# EAGLE design scanner (EAGLE 9.2.2)

## Sheet 1 of 3: IO
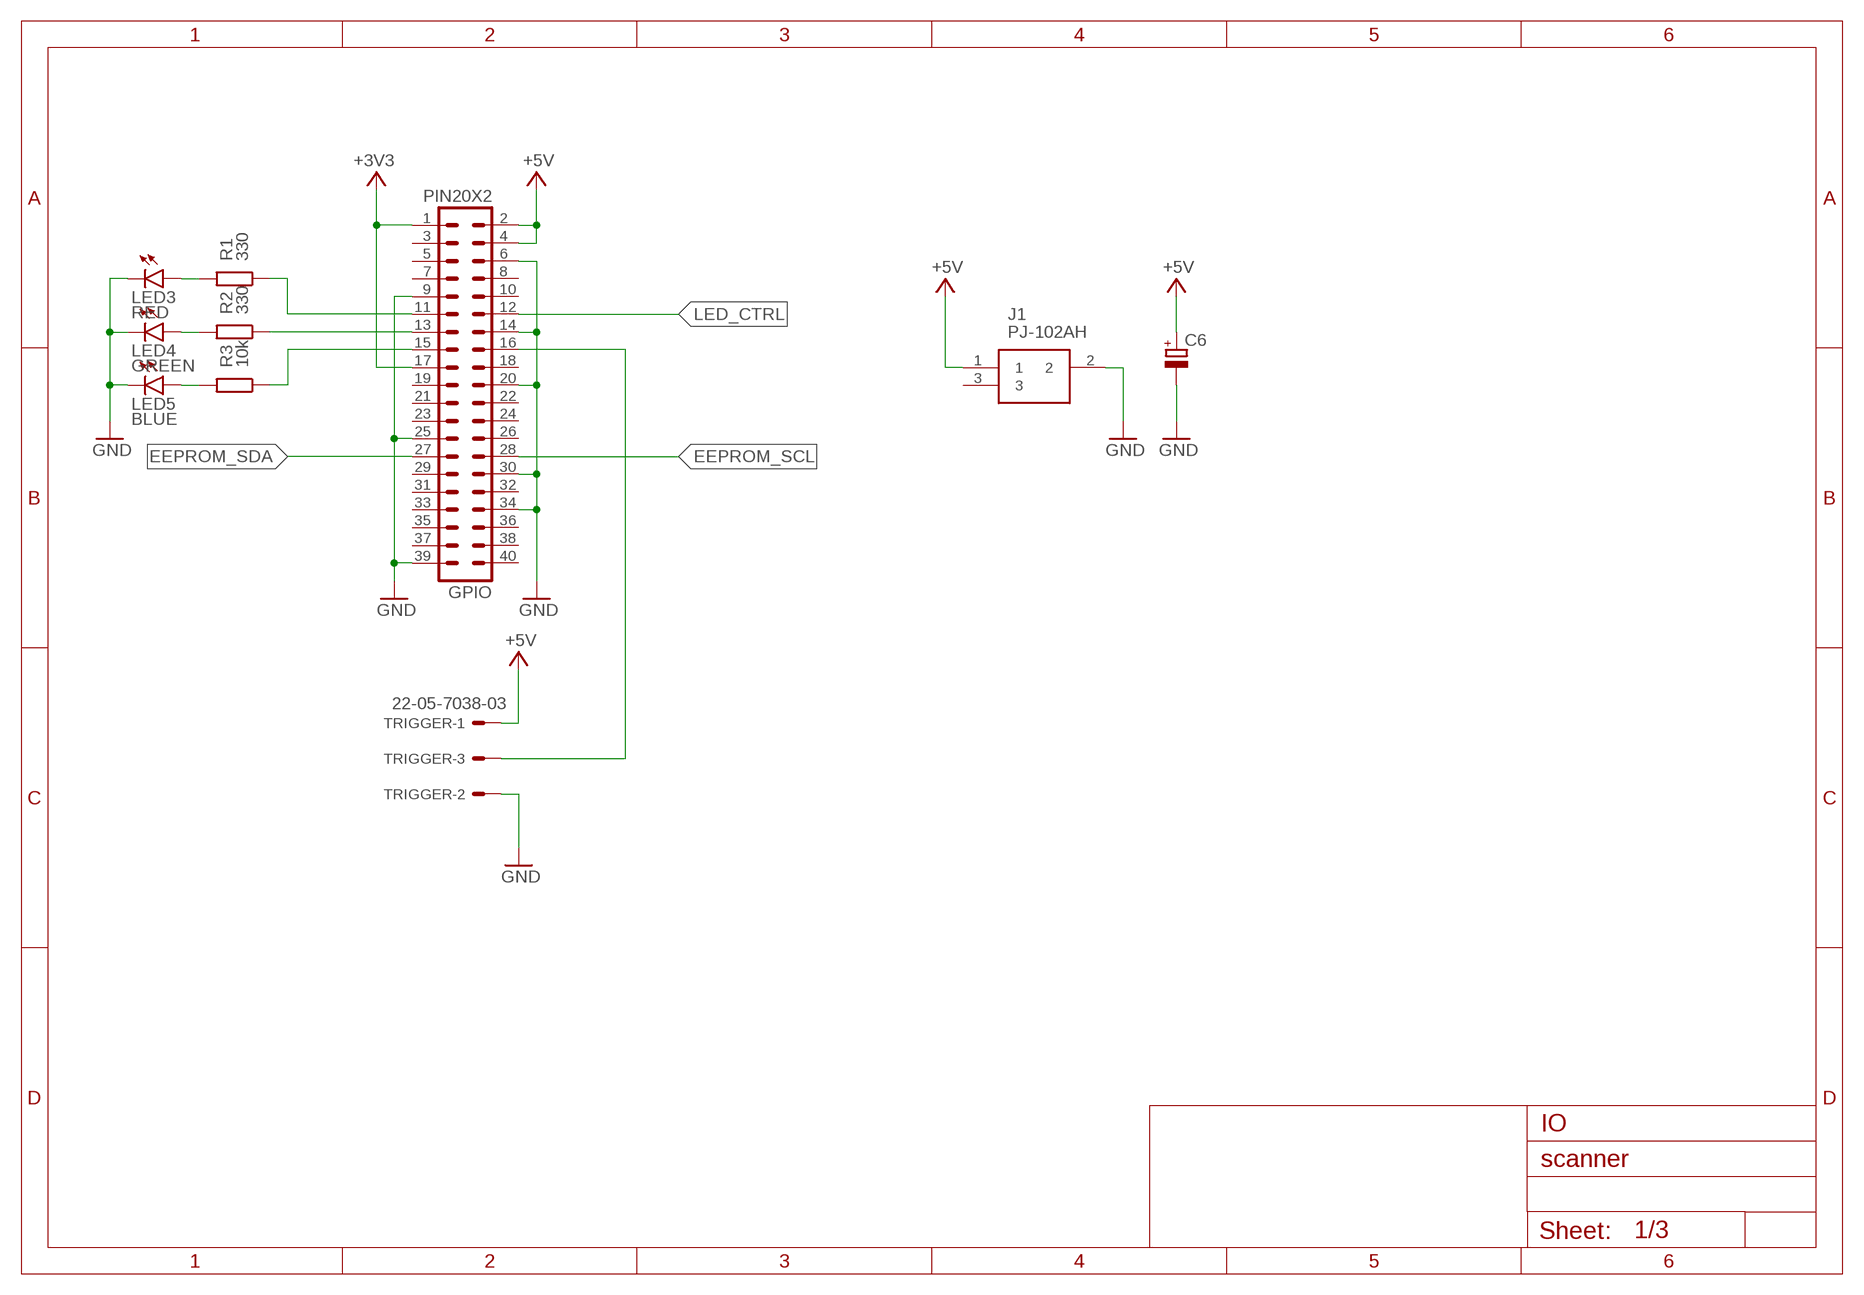
[diagram p0: schematic, sheet 1]

### Parts
C6  CPOL-EUCT6032  [CT6032]
GPIO  PIN20X2  [PIN_20X2]
J1  PJ-102AH  [PJ-102AH]
LED3  RED  LEDCHIP-LED0805  [CHIP-LED0805]
LED4  GREEN  LEDCHIP-LED0805  [CHIP-LED0805]
LED5  BLUE  LEDCHIP-LED0805  [CHIP-LED0805]
R1  330  R-EU_M0805  [M0805]
R2  330  R-EU_M0805  [M0805]
R3  10k  R-EU_M0805  [M0805]
TRIGGER  22-05-7038-03  [7395-03]

### Nets
+3V3: GPIO.1 GPIO.17 ; also sheet 2,3
+5V: C6.+ GPIO.2 GPIO.4 J1.1 TRIGGER.1 ; also sheet 2
EEPROM_SCL: GPIO.28 ; also sheet 3
EEPROM_SDA: GPIO.27 ; also sheet 3
GND: C6.- GPIO.6 GPIO.9 GPIO.14 GPIO.20 GPIO.25 GPIO.30 GPIO.34 GPIO.39 J1.2 LED3.C LED4.C LED5.C TRIGGER.2 ; also sheet 2,3
LED3: GPIO.11 R1.1
LED4: GPIO.13 R2.1
LED5: GPIO.15 R3.1
LED_CTRL: GPIO.12 ; also sheet 2
N$13: LED3.A R1.2
N$17: LED4.A R2.2
N$18: LED5.A R3.2
TRIGGER: GPIO.16 TRIGGER.3
Unconnected: GPIO.3 GPIO.5 GPIO.7 GPIO.8 GPIO.10 GPIO.18 GPIO.19 GPIO.21 GPIO.22 GPIO.23 GPIO.24 GPIO.26 GPIO.29 GPIO.31 GPIO.32 GPIO.33 GPIO.35 GPIO.36 GPIO.37 GPIO.38 GPIO.40 J1.3

### Notes on the sheet
- IO

## Sheet 2 of 3: LED Driver
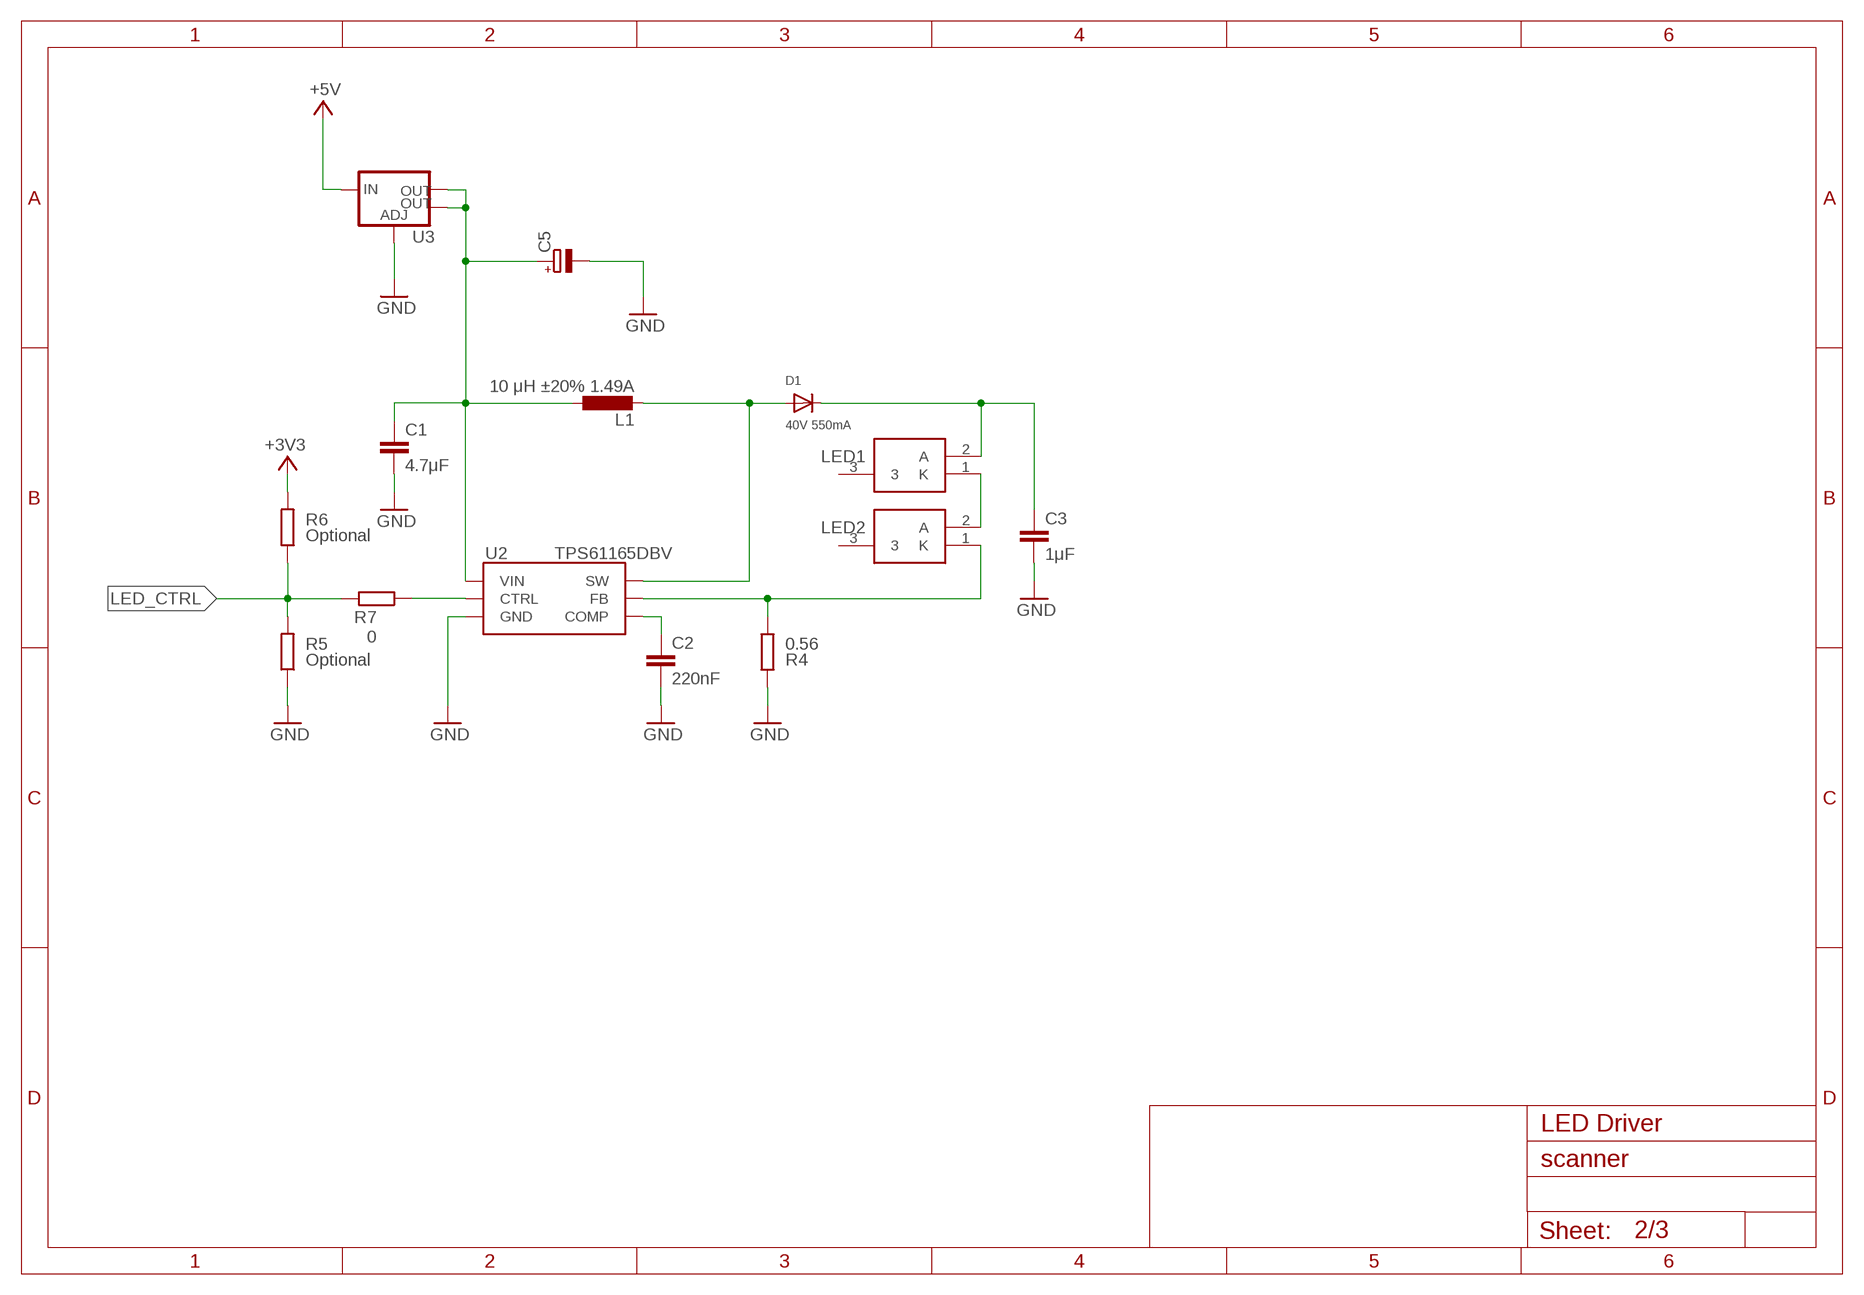
[diagram p1: schematic, sheet 2]

### Parts
C1  4.7μF  C-EUC0805K  [C0805K]
C2  220nF  C-EUC0805K  [C0805K]
C3  1μF  C-EUC0805K  [C0805K]
C5  CPOL-EUCT6032  [CT6032]
D1  40V 550mA  DIODESOD-123  [SOD-123]
L1  10 μH ±20% 1.49A  D53LC  [D53LC]
LED1  LW_W5SM-JYKY-JKQL-1  [LWW5SMJYKYJKQL1]
LED2  LW_W5SM-JYKY-JKQL-1  [LWW5SMJYKYJKQL1]
R4  0.56  R-EU_M0805  [M0805]
R5  Optional  R-EU_M0805  [M0805]
R6  Optional  R-EU_M0805  [M0805]
R7  0  R-EU_M0805  [M0805]
U2  TPS61165DBV  [SOT-23-6]
U3  V_REG_LM1117SOT223  [SOT223]

### Nets
+3V3: R6.2 ; also sheet 1,3
+5V: U3.3(IN) ; also sheet 1
GND: C1.2 C2.2 C3.2 C5.- R4.2 R5.1 U2.4(GND) U3.1(ADJ) ; also sheet 1,3
LED_COMP: C2.1 U2.5(COMP)
LED_CTRL: R5.2 R6.1 R7.2 ; also sheet 1
LED_CTRL1: R7.1 U2.2(CTRL)
LED_FB: LED2.1(K) R4.1 U2.6(FB)
LED_SW: D1.A L1.2 U2.3(SW)
N$2: C3.1 D1.C LED1.2(A)
N$3: LED1.1(K) LED2.2(A)
VCC: C1.1 C5.+ L1.1 U2.1(VIN) U3.2(OUT) U3.4(OUT)
Unconnected: LED1.3 LED2.3

### Notes on the sheet
- LED Driver

## Sheet 3 of 3: EEPROM
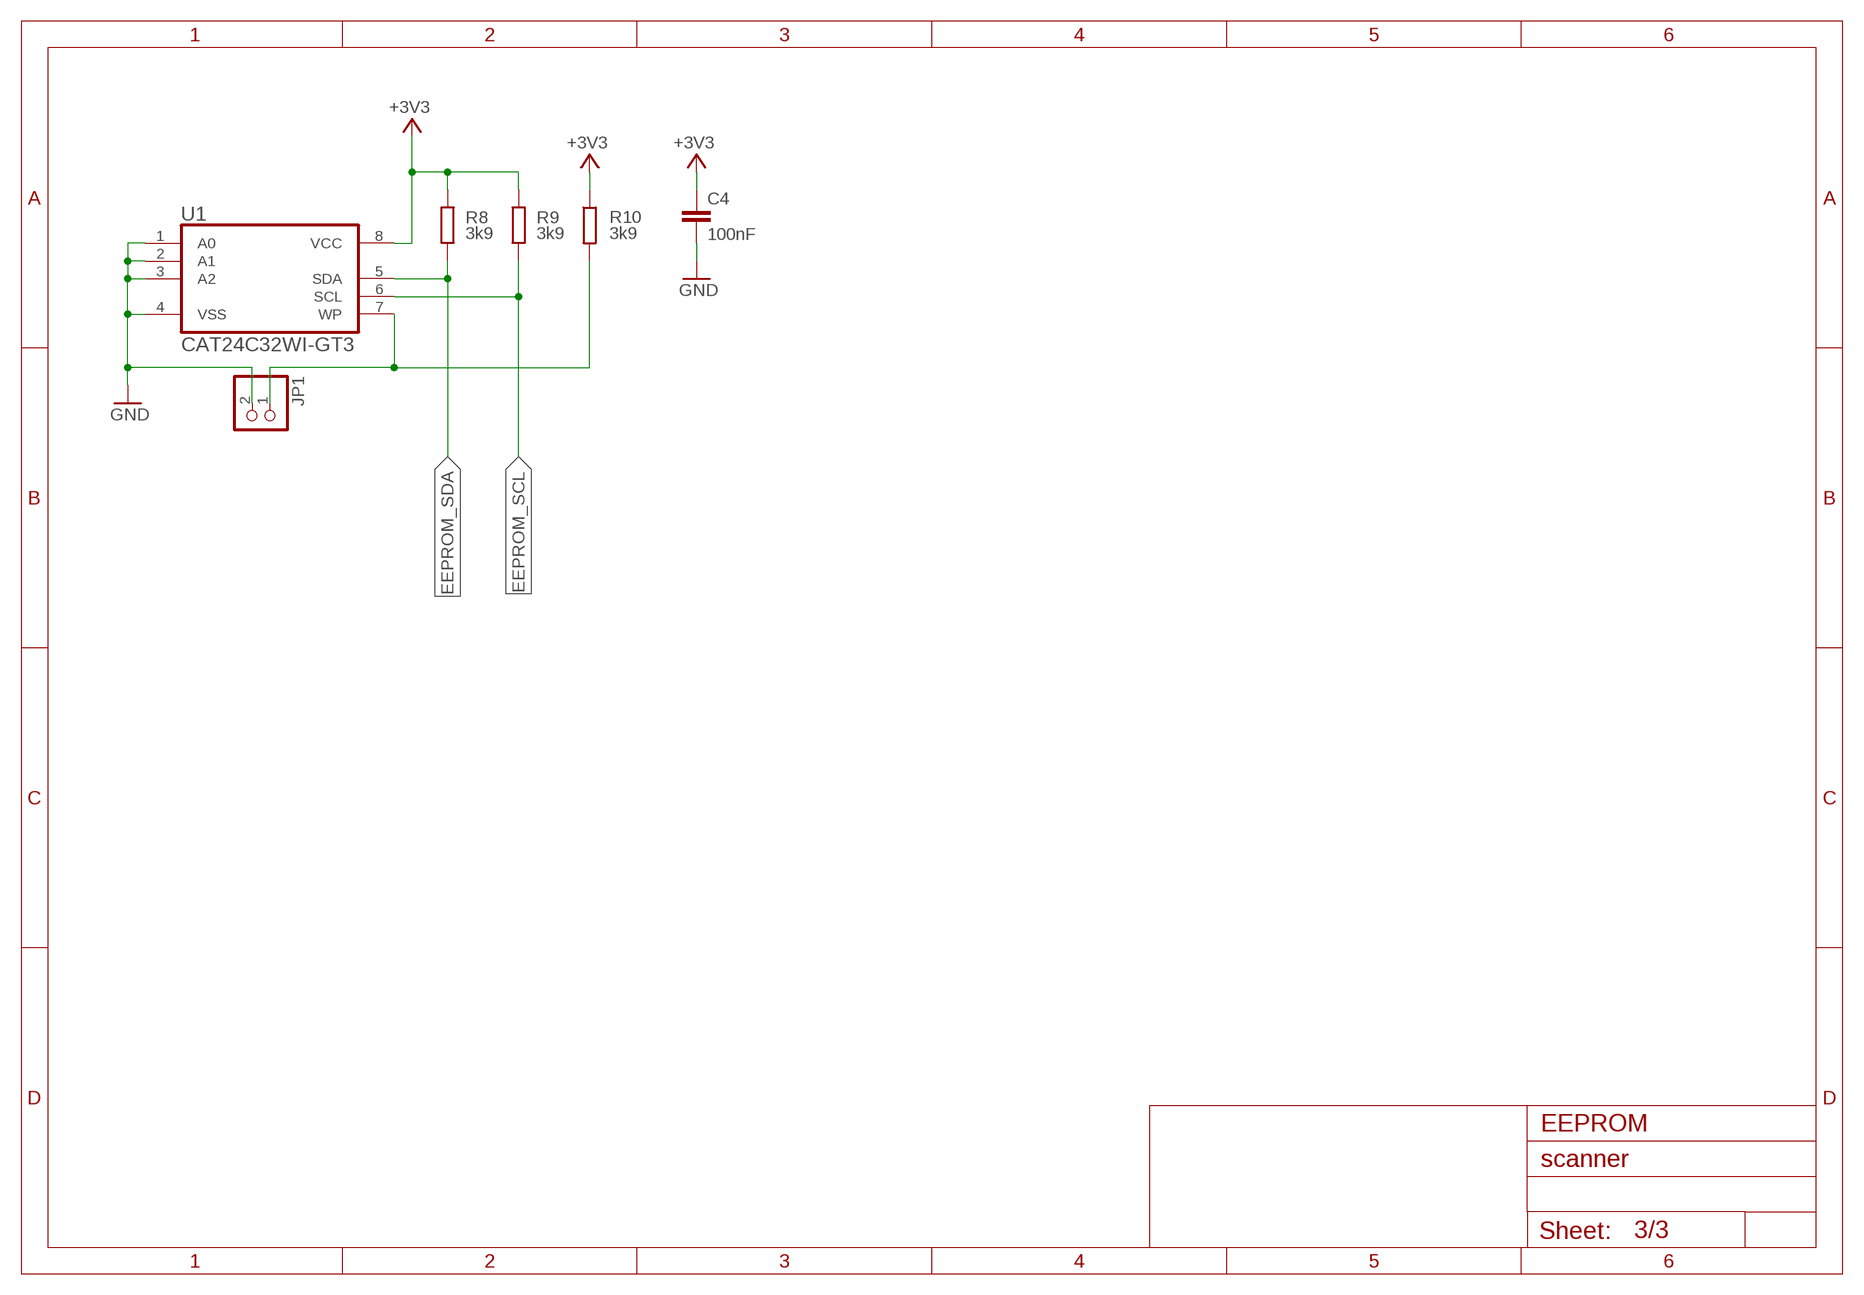
[diagram p2: schematic, sheet 3]

### Parts
C4  100nF  C-EUC0805K  [C0805K]
JP1  PINHD-1X2  [1X02]
R8  3k9  R-EU_M0805  [M0805]
R9  3k9  R-EU_M0805  [M0805]
R10  3k9  R-EU_M0805  [M0805]
U1  CAT24C32WI-GT3  [SOIC127P600X175-8N]

### Nets
+3V3: C4.1 R8.2 R9.2 R10.1 U1.8(VCC) ; also sheet 1,2
EEPROM_SCL: R9.1 U1.6(SCL) ; also sheet 1
EEPROM_SDA: R8.1 U1.5(SDA) ; also sheet 1
EEPROM_WP: JP1.1 R10.2 U1.7(WP)
GND: C4.2 JP1.2 U1.1(A0) U1.2(A1) U1.3(A2) U1.4(VSS) ; also sheet 1,2

### Notes on the sheet
- EEPROM

## Library data of the parts
C1-C4 = resistor:C-EU: CAPACITOR, European symbol; DIELECTRIC: X7R
C5 C6 = rcl:CPOL-EU: POLARIZED CAPACITOR, European symbol; SPICEPREFIX: C
D1 = adafruit:DIODE: Diode SMADIODE - SMA Surface Mount Package 20V 1A Schottky Diode Digikey: 641-1014-6-ND DO-1N4148 - Through Hole Small Current Diode SOD-123 20V 1 A (.5mV Vf) Schottky Diode - Digikey: MBRX120TPMSCT-ND SOD-323 10V 570mA (.38mV Vf, 3ns) Schottky Diode - Digikey: ZLLS410CT-ND SOD-523 30V 30mA Schottky Diode (RB751S-40TE61) - Digikey: RB751S-40TE61CT-ND SOT23-R/W - SOT23 Package (R = Solder Paste/Reflow Ovens, W = Hand-Soldering) BAT54Film 40V 300mA - Digikey: 497-7162-1-ND
GPIO = FLYFISH:PIN20X2
J1 = PJ-102AH:PJ-102AH: DC POWER JACK Source: Datasheet <https://componentsearchengine.com/Datasheets/1/PJ-102AH.pdf>; DESCRIPTION: DC POWER JACK; HEIGHT: mm; MANUFACTURER_NAME: CUI; MANUFACTURER_PART_NUMBER: PJ-102AH; MOUSER_PART_NUMBER: 490-PJ-102AH
JP1 = pinhead:PINHD-1X2: PIN HEADER
L1 = m-pad-2.1:D53LC: TOKO's D53LC Fixed Inductors for Surface Mounting TYPE D53LC Inductance Range:1.1 - 220mH Frequency Range: 0.1 - 1MHz Features Low profile (3.0mm max.) Magnetically shielded Available on tape and reel for auto-insertion Suitable for reflow soldering Part Number A915AY-xxxM Please send any comments to: messi@users.sourceforge.net
LED1 LED2 = LW_W5SM-JYKY-JKQL-1:LW_W5SM-JYKY-JKQL-1: High Power LEDs - White White, 5600K Source: Datasheet <https://www.osram.com/os/ecat/Golden DRAGON LW W5SM/com/en/class_pim_web_catalog_103489/global/prd_pim_device_2190693/>; DESCRIPTION: High Power LEDs - White White, 5600K; HEIGHT: 1mm; MANUFACTURER_NAME: OSRAM Opto Semiconductors; MANUFACTURER_PART_NUMBER: LW W5SM-JYKY-JKQL-1; MOUSER_PART_NUMBER: 720-LWW5SMJYKYJKQL1; MOUSER_PRICE-STOCK: https://www.mouser.com/Search/Refine.aspx?Keyword=720-LWW5SMJYKYJKQL1
LED3-LED5 = led:LED: LED OSRAM: - CHIPLED LG R971, LG N971, LY N971, LG Q971, LY Q971, LO R971, LY R971 LH N974, LH R974 LS Q976, LO Q976, LY Q976 LO Q996 - Hyper CHIPLED LW Q18S LB Q993, LB Q99A, LB R99A - SideLED LS A670, LO A670, LY A670, LG A670, LP A670 LB A673, LV A673, LT A673, LW A673 LH A674 LY A675 LS A676, LA A676, LO A676, LY A676, LW A676 LS A679, LY A679, LG A679 - Hyper Micro SIDELED® LS Y876, LA Y876, LO Y876, LY Y876 LT Y87S - SmartLED LW L88C, LW L88S LB L89C, LB L89S, LG L890 LS L89K, LO L89K, LY L89K LS L896, LA L896, LO L896, LY L896 - TOPLED LS T670, LO T670, LY T670, LG T670, LP T670 LSG T670, LSP T670, LSY T670, LOP T670, LYG T670 LG T671, LOG T671, LSG T671 LB T673, LV T673, LT T673, LW T673 LH T674 LS T676, LA T676, LO T676, LY T676, LB T676, LH T676, LSB T676, LW T676 LB T67C, LV T67C, LT T67C, LS T67K, LO T67K, LY T67K, LW E67C LS E67B, LA E67B, LO E67B, LY E67B, LB E67C, LV E67C, LT E67C LW T67C LS T679, LY T679, LG T679 LS T770, LO T770, LY T770, LG T770, LP T770 LB T773, LV T773, LT T773, LW T773 LH T774 LS E675, LA E675, LY E675, LS T675 LS T776, LA T776, LO T776, LY T776, LB T776 LHGB T686 LT T68C, LB T68C - Hyper Mini TOPLED® LB M676 - Mini TOPLED Santana® LG M470 LS M47K, LO M47K, LY M47K Source: http://www.osram.convergy.de LUXEON: - LUMILED® LXK2-PW12-R00, LXK2-PW12-S00, LXK2-PW14-U00, LXK2-PW14-V00 LXK2-PM12-R00, LXK2-PM12-S00, LXK2-PM14-U00 LXK2-PE12-Q00, LXK2-PE12-R00, LXK2-PE12-S00, LXK2-PE14-T00, LXK2-PE14-U00 LXK2-PB12-K00, LXK2-PB12-L00, LXK2-PB12-M00, LXK2-PB14-N00, LXK2-PB14-P00, LXK2-PB14-Q00 LXK2-PR12-L00, LXK2-PR12-M00, LXK2-PR14-Q00, LXK2-PR14-R00 LXK2-PD12-Q00, LXK2-PD12-R00, LXK2-PD12-S00 LXK2-PH12-R00, LXK2-PH12-S00 LXK2-PL12-P00, LXK2-PL12-Q00, LXK2-PL12-R00 Source: www.luxeon.com KINGBRIGHT: KA-3528ASYC Source: www.kingbright.com
R1-R10 = resistor:R-EU_: RESISTOR, European symbol; TOLERANCE: 5%
TRIGGER = con-molex:22-?-03: CONNECTOR wire to board 2.54 mm (.1 inch) pitch header; MF: MOLEX; OC_FARNELL: unknown; OC_NEWARK: unknown
U1 = mbed-HDK-IC:CAT24C32WI-GT3: EEPROM I2C 32-Kb I2C CMOS; MPN: CAT24C32WI-GT3; OC_FARNELL: 1718129; OC_NEWARK: 08R5414; PACKAGE: SOIC-8; SUPPLIER: CATALYST SEMICONDUCTOR
U2 = dword1511-pmic-dcdc:TPS61165: Boost LED driver
U3 = SparkFun-IC-Power:V_REG_LM1117: Voltage Regulator LM1117 Standard adjustable voltage regulator but in SMD form. Spark Fun Electronics SKU : COM-00595; PROD_ID: VREG-08170

## Board
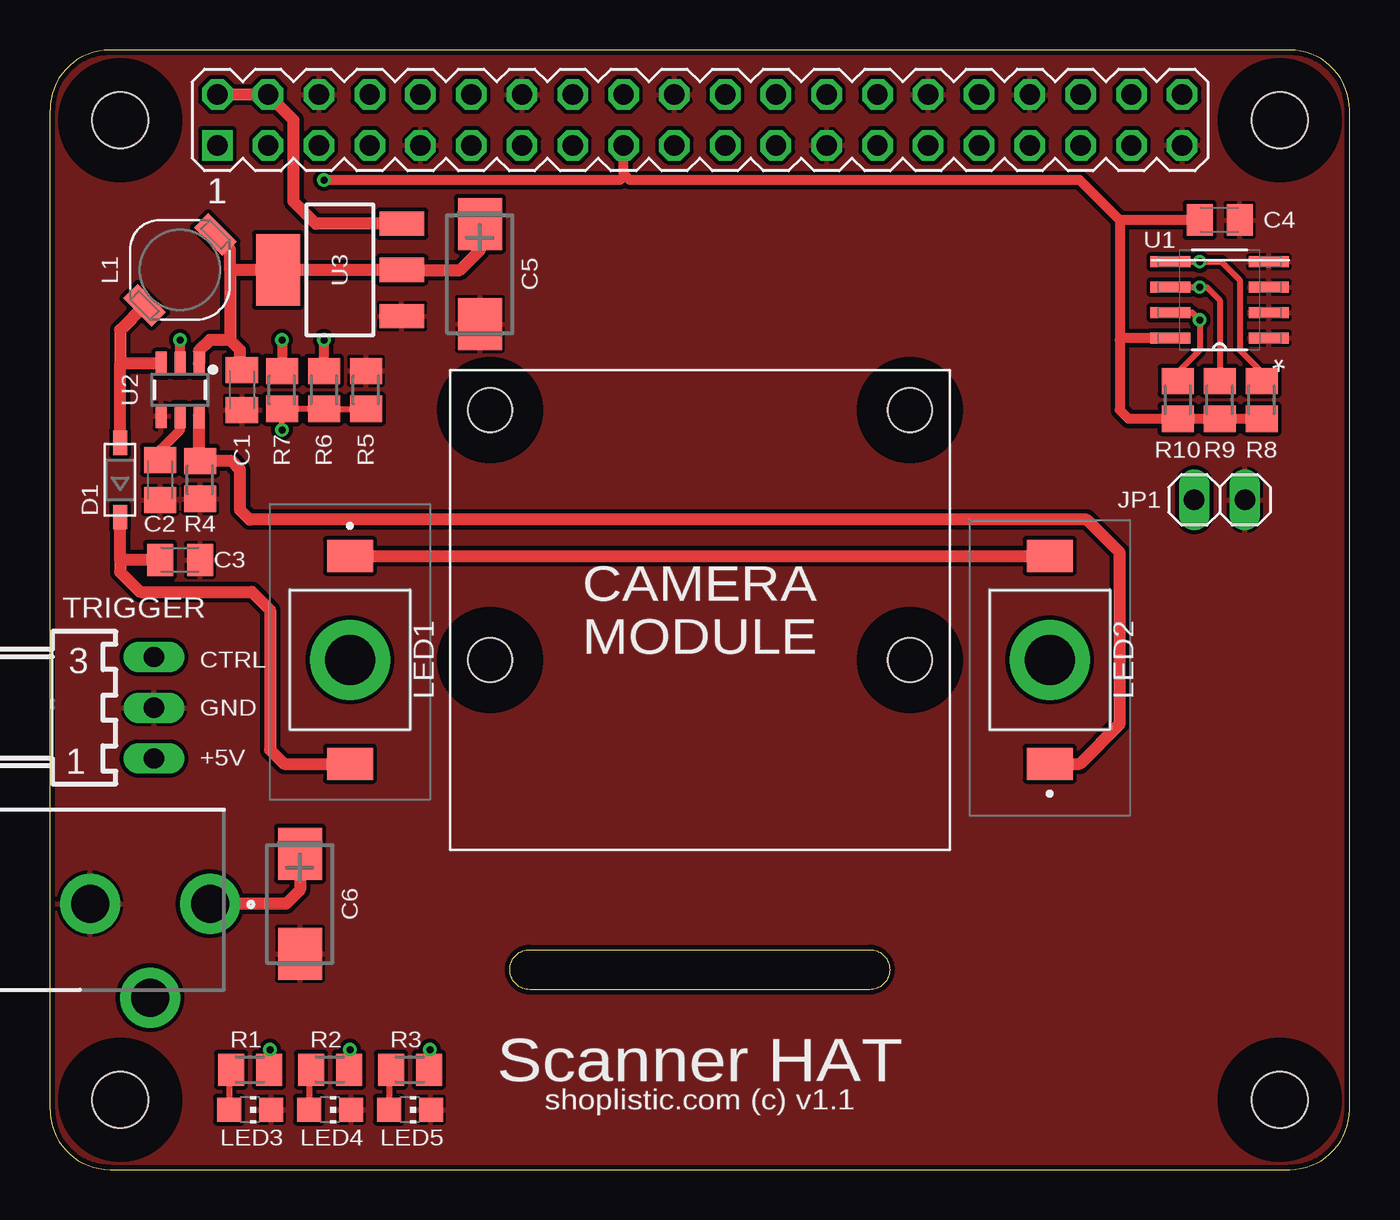
[diagram p3: board, top side]
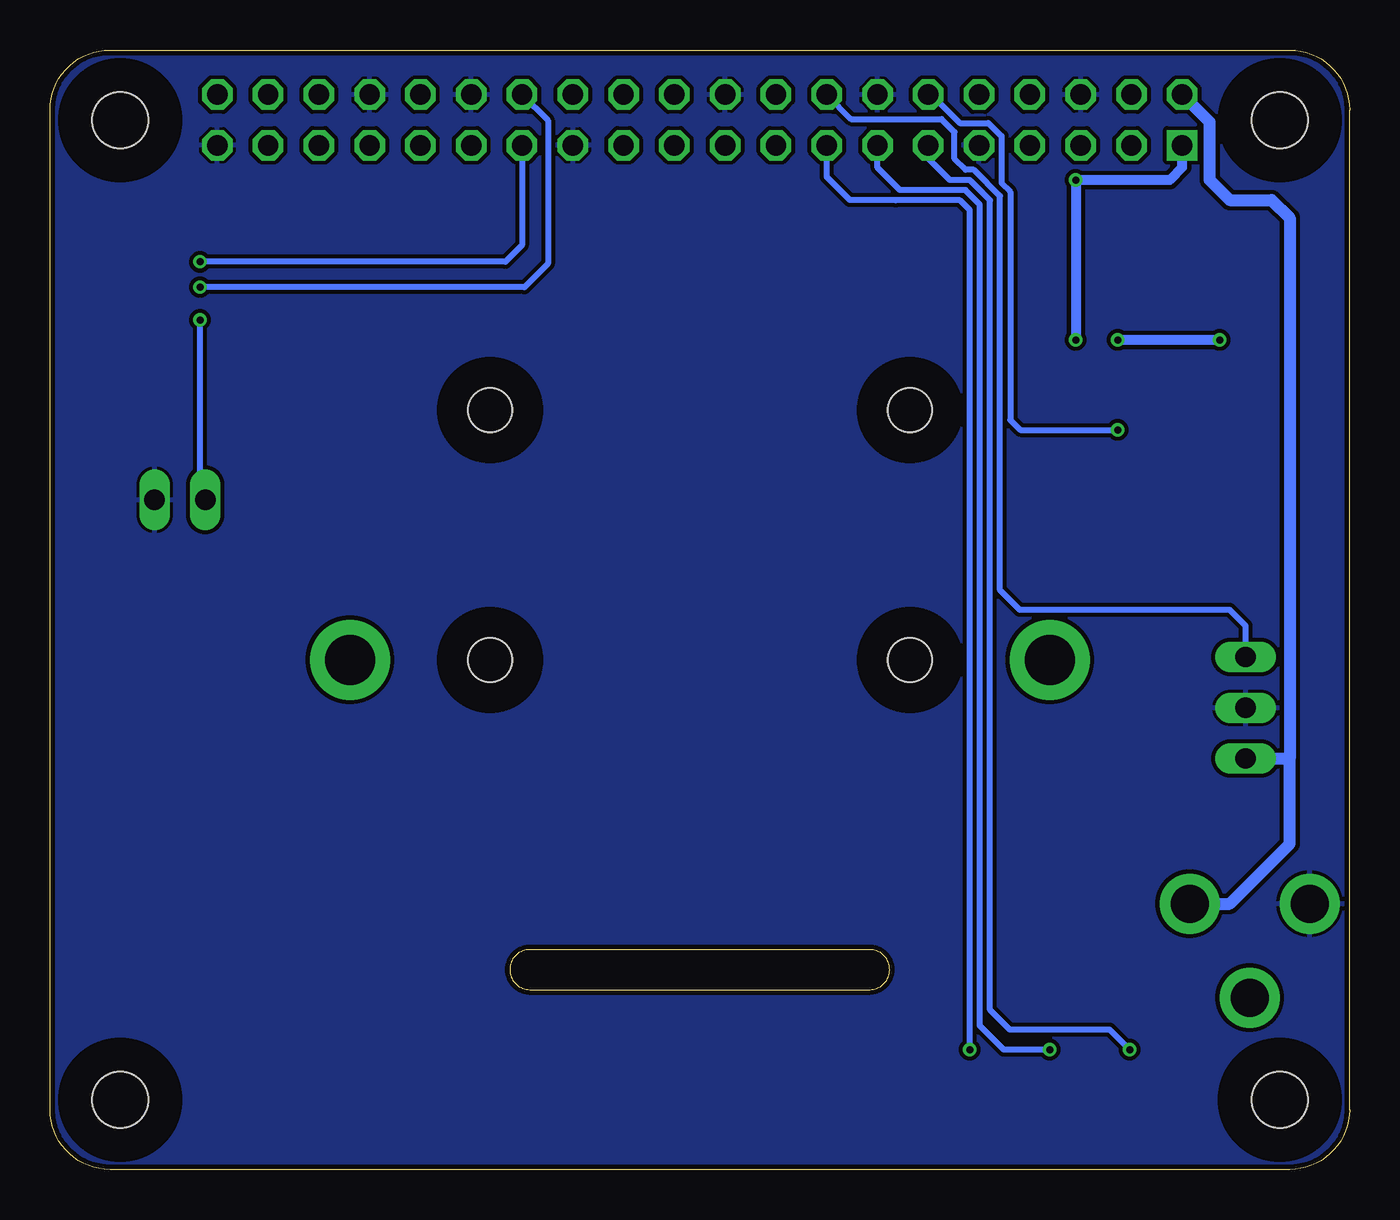
[diagram p4: board, bottom side, seen from below]

Size 65 x 56 mm. Coordinates in mm from the lower left corner, seen from the top.
Outline: 0,3 arc90 3,0 62,0 arc90 65,3 65,53 arc90 62,56 3,56 arc90 0,53 0,3
Outline: 23,10 arc-90 24,11 41,11 arc-90 42,10 arc-90 41,9 24,9 arc-90 23,10
Copper layers (1*16): Top 0.035mm / dielectric 1.5mm / Bottom 0.035mm
Design rules "ITEADstudio_DRC *": minimum track width 6mil, minimum drill 12mil, track to track 8mil, track to pad 8mil, pad to pad 8mil, via to via 8mil, smd to smd 0mil, copper to edge 10mil, drill to drill 10mil, minimum pad ring 10mil, minimum via ring 6mil, stop-mask expansion 2mil, vias tented up to drill 100mil, thermal gap 6mil
Holes 2.8 mm at 3.5,3.5 3.5,52.5 61.5,52.5 61.5,3.5
Holes 2.2 mm at 22,38 43,38 43,25.5 22,25.5
tRestrict: area 1.9,51 to 5,54; area 60,51 to 63,54; area 60,1.9 to 63,5; area 1.9,1.9 to 5,5; area 20.9,36.9 to 23.1,39.1; area 41.9,36.9 to 44.1,39.1; area 41.9,24.4 to 44.1,26.6; area 20.9,24.4 to 23.1,26.6
bRestrict: area 1.9,1.9 to 5,5; area 60,1.9 to 63,5; area 60,51 to 63,54; area 1.9,51 to 5,54; area 20.9,36.9 to 23.1,39.1; area 41.9,36.9 to 44.1,39.1; area 41.9,24.4 to 44.1,26.6; area 20.9,24.4 to 23.1,26.6
Milling: 6 lines

### Footprints (pad centres in the part's own frame; a part is rotated, then mirrored left to right if it is on the bottom)
C0805K = smd 1.3 x 1.6: 1 -1,0; 2 1,0
CT6032 = smd 2.6 x 2.2: + -2.5,0; - 2.5,0
SOD-123 = smd 1.2 x 0.7: A 1.85,0; C -1.85,0
PIN_20X2 = drill 1.016 square: 1 -24.13,-1.27 | drill 1.016 octagon: 2 -24.13,1.27; 3 -21.59,-1.27; 4 -21.59,1.27; 5 -19.05,-1.27; 6 -19.05,1.27; 7 -16.51,-1.27; 8 -16.51,1.27; 9 -13.97,-1.27; 10 -13.97,1.27; 11 -11.43,-1.27; 12 -11.43,1.27; 13 -8.89,-1.27; 14 -8.89,1.27; 15 -6.35,-1.27; 16 -6.35,1.27; 17 -3.81,-1.27; 18 -3.81,1.27; 19 -1.27,-1.27; 20 -1.27,1.27; 21 1.27,-1.27; 22 1.27,1.27; 23 3.81,-1.27; 24 3.81,1.27; 25 6.35,-1.27; 26 6.35,1.27; 27 8.89,-1.27; 28 8.89,1.27; 29 11.43,-1.27; 30 11.43,1.27; 31 13.97,-1.27; 32 13.97,1.27; 33 16.51,-1.27; 34 16.51,1.27; 35 19.05,-1.27; 36 19.05,1.27; 37 21.59,-1.27; 38 21.59,1.27; 39 24.13,-1.27; 40 24.13,1.27
PJ-102AH = drill 1.9 pad 3: 1 4.3,-3; 2 4.3,3; 3 -0.4,0
1X02 = drill 1.016 long: 1 -1.27,0; 2 1.27,0
D53LC = smd 1 x 2: 1 -2.5,0; 2 2.5,0
LWW5SMJYKYJKQL1 = smd 1.6 x 2.3: 1 -5.2,0; 2 5.2,0 | drill 2.5 pad 4: 3 0,0
CHIP-LED0805 = smd 1.2 x 1.2: A 0,-1.05; C 0,1.05
M0805 = smd 1.3 x 1.6: 1 -0.95,0; 2 0.95,0
7395-03 = drill 1.016 long: 1 2.54,0; 2 0,0; 3 -2.54,0
SOIC127P600X175-8N = smd 1.981 x 0.559: 1 -2.464,1.905; 2 -2.464,0.635; 3 -2.464,-0.635; 4 -2.464,-1.905; 5 2.464,-1.905; 6 2.464,-0.635; 7 2.464,0.635; 8 2.464,1.905
SOT-23-6 = smd 0.55 x 1.2: 1 -0.95,-1.3; 2 0,-1.3; 3 0.95,-1.3; 4 0.95,1.3; 5 0,1.3; 6 -0.95,1.3
SOT223 = smd 1.219 x 2.235: 1 -2.311,-3.099; 2 0,-3.099; 3 2.311,-3.099 | smd 3.6 x 2.2: 4 0,3.099

### Placement (x,y rotation side)
C1  9.6,39 270 top
C2  5.5,34.5 270 top
C3  6.5,30.5 0 top
C4  58.5,47.5 0 top
C5  21.5,44.8 270 top
C6  12.5,13.3 270 top
D1  3.5,34.5 90 top
GPIO  32.5,52.5 0 top
J1  5,9 90 top
JP1  58.5,33.5 0 top
L1  6.5,45 225 top
LED1  15,25.5 270 top
LED2  50,25.5 90 top
LED3  10,3 270 top
LED4  14,3 270 top
LED5  18,3 270 top
R1  10,5 180 top
R2  14,5 180 top
R3  18,5 180 top
R4  7.5,34.5 270 top
R5  15.8,39 270 top
R6  13.7,39 90 top
R7  11.6,39 270 top
R8  60.6,38.5 270 top
R9  58.5,38.5 270 top
R10  56.4,38.5 90 top
TRIGGER  5.2,23.1 270 top
U1  58.5,43.5 180 top
U2  6.5,39 180 top
U3  14.5,45 90 top

### Tracks (layer width: path | path; a pad name or v marks a point on that pad's centre or on a via)
+3V3  (via drill 0.35)
  Top 0.508: R8.2 R9.2 R10.1 53.95,37.55 53.5,38 53.5,41.5 | 53.5,47.5 53.5,41.5 | C4.1 53.5,47.5 | 53.5,47.5 51.5,49.5 29,49.5 28.75,49.75 | 28.75,49.75 28.69,49.81 GPIO.17 | U1.8 53.59,41.59 53.5,41.5 | R6.2 v13.7,41.5 | 28.75,49.75 28.5,49.5 v13.7,49.5
  Bottom 0.508: GPIO.1 8.37,50.13 9,49.5 v13.7,49.5 v13.7,41.5
+5V
  Top 0.61: GPIO.2 GPIO.4 12.18,52.5 12.18,48.42 13.29,47.31 U3.3 | C6.+ 12.5,14 11.8,13.3 J1.1
  Bottom 0.61: 3,20.56 3,47.6 3.9,48.5 6,48.5 7,49.5 7,52.4 GPIO.2 | TRIGGER.1 3,20.56 | J1.1 6,13.3 3,16.3 3,20.56
EEPROM_SCL  (via drill 0.35)
  Top 0.305: R9.1 58.5,43.5 57.87,44.13 v57.5,44.13 U1.6
  Bottom 0.305: GPIO.28 40.1,52.48 40.1,45.3 41.27,44.13 v57.5,44.13
EEPROM_SDA  (via drill 0.35)
  Top 0.305: R8.1 60.6,39.9 59.5,41 59.5,44.5 58.59,45.41 v57.5,45.41 U1.5
  Bottom 0.305: GPIO.27 41.39,46.23 42.22,45.41 v57.5,45.41
EEPROM_WP  (via drill 0.35)
  Top 0.305: R10.2 56.4,39.9 57.5,41 v57.5,42.5 57.13,42.87 U1.7
  Bottom 0.305: JP1.1 57.5,33.77 v57.5,42.5
GND
  pour Bottom: -1,57 -1,-1 66,-1 66,57
  pour Top: -1,57 -1,-1 66,-1 66,57
LED3  (via drill 0.35)
  Top 0.305: R1.1 10.95,5.95 v11,6
  Bottom 0.305: v11,6 12,7 17,7 17.98,7.98 17.98,48.48 19,49.5 20,49.5 21.07,50.57 GPIO.11
LED4  (via drill 0.35)
  Top 0.305: R2.1 14.95,5.95 v15,6
  Bottom 0.305: v15,6 17.3,6 18.49,7.19 18.49,48.27 19.21,48.99 20.21,48.99 20.22,49 22.5,49 23.61,50.11 GPIO.13
LED5  (via drill 0.35)
  Top 0.305: R3.1 19,5.05 v19,6
  Bottom 0.305: GPIO.15 26.15,49.65 25,48.5 22.72,48.5 22.7,48.48 19.48,48.48 19,48 v19,6
LED_COMP
  Top 0.508: C2.1 5.5,36 6.5,37 U2.5
LED_CTRL  (via drill 0.35)
  Top 0.305: R5.2 R6.1 R7.2 v11.6,37
  Bottom 0.305: GPIO.12 20.91,53.77 19.49,52.35 18.07,52.35 17.41,51.69 17.41,49.35 16.97,48.91 16.97,37.5 16.47,37 v11.6,37
LED_CTRL1  (via drill 0.35)
  Top 0.508: U2.2 v6.5,41.5 | v11.6,41.5 R7.1
  Bottom 0.508: v6.5,41.5 v11.6,41.5
LED_FB
  Top 0.61: U2.6 7.45,35.5 R4.1 9.05,35.45 9.5,35 9.5,33 9.99,32.51 51.86,32.51 53.51,30.86 53.51,22.31 51.5,20.3 LED2.1
LED_SW
  Top 0.61: L1.2 3.5,42 3.5,40.3 | U2.3 3.5,40.3 | 3.5,40.3 | D1.A | D1.A 3.5,40.3
N$2
  Top 0.61: 3.5,30.5 D1.C | C3.1 3.5,30.5 | 3.5,30.5 3.5,29.9 4.5,28.9 10.1,28.9 11,28 11,21 11.7,20.3 LED1.2
N$3
  Top 0.61: LED1.1 LED2.2
N$13
  Top 0.305: R1.2 8.95,4.9 LED3.A
N$17
  Top 0.305: R2.2 12.95,4.9 LED4.A
N$18
  Top 0.305: R3.2 16.95,4.9 LED5.A
TRIGGER
  Bottom 0.305: GPIO.16 24.93,52.55 20.41,52.55 19.75,51.89 19.75,50.56 19.2,50.01 18.79,50.01 17.48,48.69 17.48,28.98 16.5,28 6,28 5.2,27.2 TRIGGER.3
VCC
  Top 0.61: L1.1 9,46.04 9,45 | 9,45 U3.4 U3.2 20.5,45 21.5,46 C5.+ | C1.1 9.5,40.1 9.5,41 9,41.5 | 9,41.5 8,41.5 7.45,40.95 U2.1 | 9,45 9,41.5

### Text on the board
tNames: CAMERA / MODULE | CTRL | GND | +5V | Scanner HAT | shoplistic.com (c) v1.1